# Altium schematic sheet Cameras.SchDoc
size A4; SheetNumber: 4; SheetTotal: 5
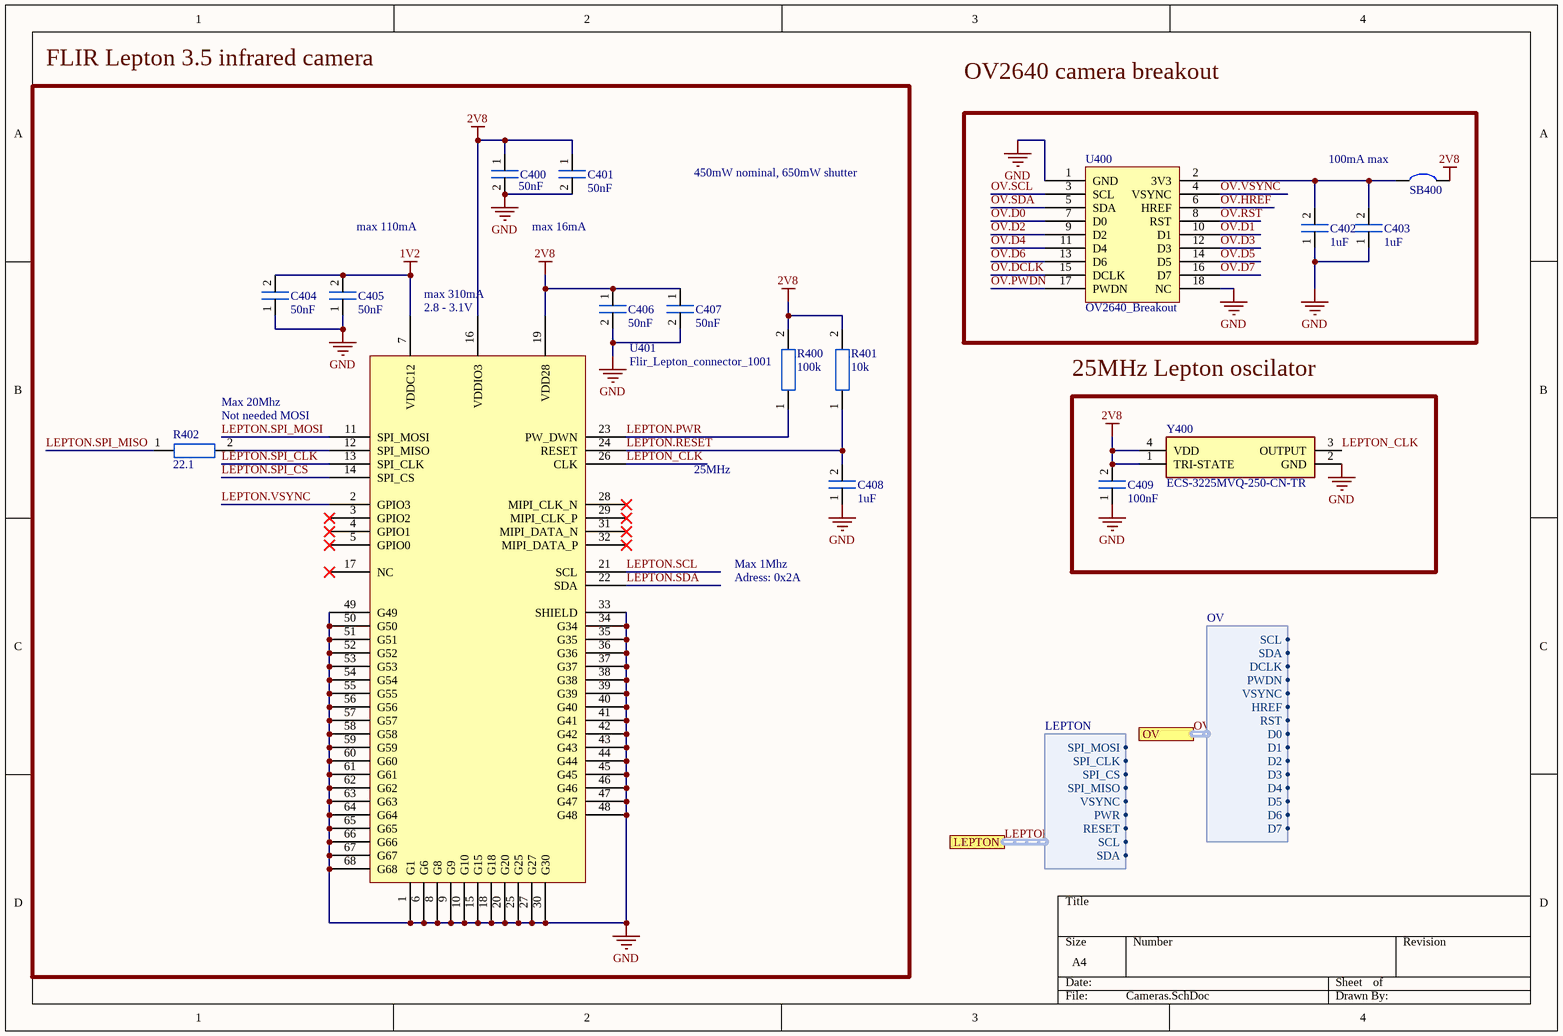
[diagram p0: Cameras.SchDoc]

## Parts
C400  50nF  [0402_footprint]
C401  50nF  [0402_footprint]
C402  1uF  [0402_footprint]
C403  1uF  [0402_footprint]
C404  50nF  [0402_footprint]
C405  50nF  [0402_footprint]
C406  50nF  [0402_footprint]
C407  50nF  [0402_footprint]
C408  1uF  [0402_footprint]
C409  100nF  [0402_footprint]
R400  100k  [0402_footprint]
R401  10k  [0402_footprint]
R402  22.1  [0402_footprint]
SB400  Solder_bridge  [SOLDER_BRIDGE]  (value not drawn)
U400  OV2640_Breakout  [OV2640_BREAKOUT]
U401  Flir_Lepton_connector_1001  [105028-1001]
Y400  ECS-3225MVQ-250-CN-TR  [ECS3225MVQ250CNTR]

## Blocks framed on the sheet
FLIR Lepton 3.5 infrared camera: C400 C401 C404-C408 R400-R402 U401
100mA max: C402 C403 SB400 U400
25MHz Lepton oscilator: C409 Y400

## Ports
LEPTON (harness LEPTON), OV (harness OV)

## Harnesses
OV: SCL, SDA, DCLK, PWDN, VSYNC, HREF, RST, D0, D1, D2, D3, D4, D5, D6, D7
LEPTON: SPI_MOSI, SPI_CLK, SPI_CS, SPI_MISO, VSYNC, PWR, RESET, SCL, SDA

## Nets
1V2: C404.2 C405.2 U401.7(VDDC12)
2V8: C400.1 C401.1 C406.1 C407.1 C409.2 R400.2 R401.2 SB400.2 U401.16(VDDIO3) U401.19(VDD28) Y400.1(TRI-STATE) Y400.4(VDD)
GND: C400.2 C401.2 C402.1 C403.1 C404.1 C405.1 C406.2 C407.2 C408.1 C409.1 U400.1(GND) U400.18(NC) U401.1(G1) U401.6(G6) U401.8(G8) U401.9(G9) U401.10(G10) U401.15(G15) U401.18(G18) U401.20(G20) U401.25(G25) U401.27(G27) U401.30(G30) U401.33(SHIELD) U401.34(G34) U401.35(G35) U401.36(G36) U401.37(G37) U401.38(G38) U401.39(G39) U401.40(G40) U401.41(G41) U401.42(G42) U401.43(G43) U401.44(G44) U401.45(G45) U401.46(G46) U401.47(G47) U401.48(G48) U401.49(G49) U401.50(G50) U401.51(G51) U401.52(G52) U401.53(G53) U401.54(G54) U401.55(G55) U401.56(G56) U401.57(G57) U401.58(G58) U401.59(G59) U401.60(G60) U401.61(G61) U401.62(G62) U401.63(G63) U401.64(G64) U401.65(G65) U401.66(G66) U401.67(G67) U401.68(G68) Y400.2(GND)
LEPTON.PWR: R400.1 U401.23(PW_DWN)
LEPTON.RESET: C408.2 R401.1 U401.24(RESET)
LEPTON.SCL: U401.21(SCL)
LEPTON.SDA: U401.22(SDA)
LEPTON.SPI_CLK: U401.13(SPI_CLK)
LEPTON.SPI_CS: U401.14(SPI_CS)
LEPTON.SPI_MISO: R402.1
LEPTON.SPI_MOSI: U401.11(SPI_MOSI)
LEPTON.VSYNC: U401.2(GPIO3)
LEPTON_CLK: U401.26(CLK) Y400.3(OUTPUT)
OV.D0: U400.7(D0)
OV.D1: U400.10(D1)
OV.D2: U400.9(D2)
OV.D3: U400.12(D3)
OV.D4: U400.11(D4)
OV.D5: U400.14(D5)
OV.D6: U400.13(D6)
OV.D7: U400.16(D7)
OV.DCLK: U400.15(DCLK)
OV.HREF: U400.6(HREF)
OV.PWDN: U400.17(PWDN)
OV.RST: U400.8(RST)
OV.SCL: U400.3(SCL)
OV.SDA: U400.5(SDA)
OV.VSYNC: U400.4(VSYNC)
NetC402_2: C402.2 C403.2 SB400.1 U400.2(3V3)
NetR402_2: R402.2 U401.12(SPI_MISO)

Not connected (* = marked no-connect by the designer): U401 3(GPIO2)* 4(GPIO1)* 5(GPIO0)* 17(NC)* 28(MIPI_CLK_N)* 29(MIPI_CLK_P)* 31(MIPI_DATA_N)* 32(MIPI_DATA_P)*

## Buses and harness runs
harness LEPTON = port LEPTON
harness OV = port OV

## Notes on the sheet
- OV2640 camera breakout
- 450mW nominal, 650mW shutter
- max 110mA
- max 16mA
- (near U401) 2.8 - 3.1V
- max 310mA
- (near R402) Not needed MOSI
- (near R402) Max 20Mhz
- 25MHz
- Max 1Mhz
- Adress: 0x2A

## Library data of the parts
C400-C409 = Capacitor_0402: 0402 capacitor
R400-R402 = Resistor_0402: 0402 resistor
U400 = OV2640_Breakout: https://www.uctronics.com/download/cam_module/OV2640DS.pdf; ComponentLink1Description: Breakout link; ComponentLink1URL: https://www.duino.lt/index.php?controller=attachment&id_attachment=447
Y400 = ECS-3225MVQ-250-CN-TR: 25MHz oscilattor; Manufacturer_Name: ECS; Datasheet Link: https://www.mouser.com/datasheet/2/122/ECS-3225MVQ-1825332.pdf; Height: 1.2mm; Manufacturer_Part_Number: ECS-3225MVQ-250-CN-TR; Mouser Part Number: 520-3225MVQ-250-CN-T; Mouser Price/Stock: https://www.mouser.co.uk/ProductDetail/ECS/ECS-3225MVQ-250-CN-TR?qs=GedFDFLaBXEiQ79b6FnYAg%3D%3D; Arrow Part Number: ECS-3225MVQ-250-CN-TR; Arrow Price/Stock: https://www.arrow.com/en/products/ecs-3225mvq-250-cn-tr/ecs-international?region=nac; ComponentLink1Description: Buy; ComponentLink1URL: https://www.mouser.lt/ProductDetail/ECS/ECS-3225MVQ-250-CN-TR?qs=GedFDFLaBXEiQ79b6FnYAg%3D%3D
U401 = Flir_Lepton_connector_1001: ComponentLink1Description: Datasheet; ComponentLink1URL: https://cdn.sparkfun.com/assets/f/6/3/4/c/Lepton_Engineering_Datasheet_Rev200.pdf; ComponentLink2Description: Buy; ComponentLink2URL: https://www.mouser.lt/ProductDetail/883-500-0771-01; ComponentLink3Description: Buy; ComponentLink3URL: https://www.mouser.lt/ProductDetail/Molex/105028-1001?qs=3OKVfsn1b5DSpyA99lGNjg%3D%3D